# EAGLE design LDO (EAGLE 6.4)
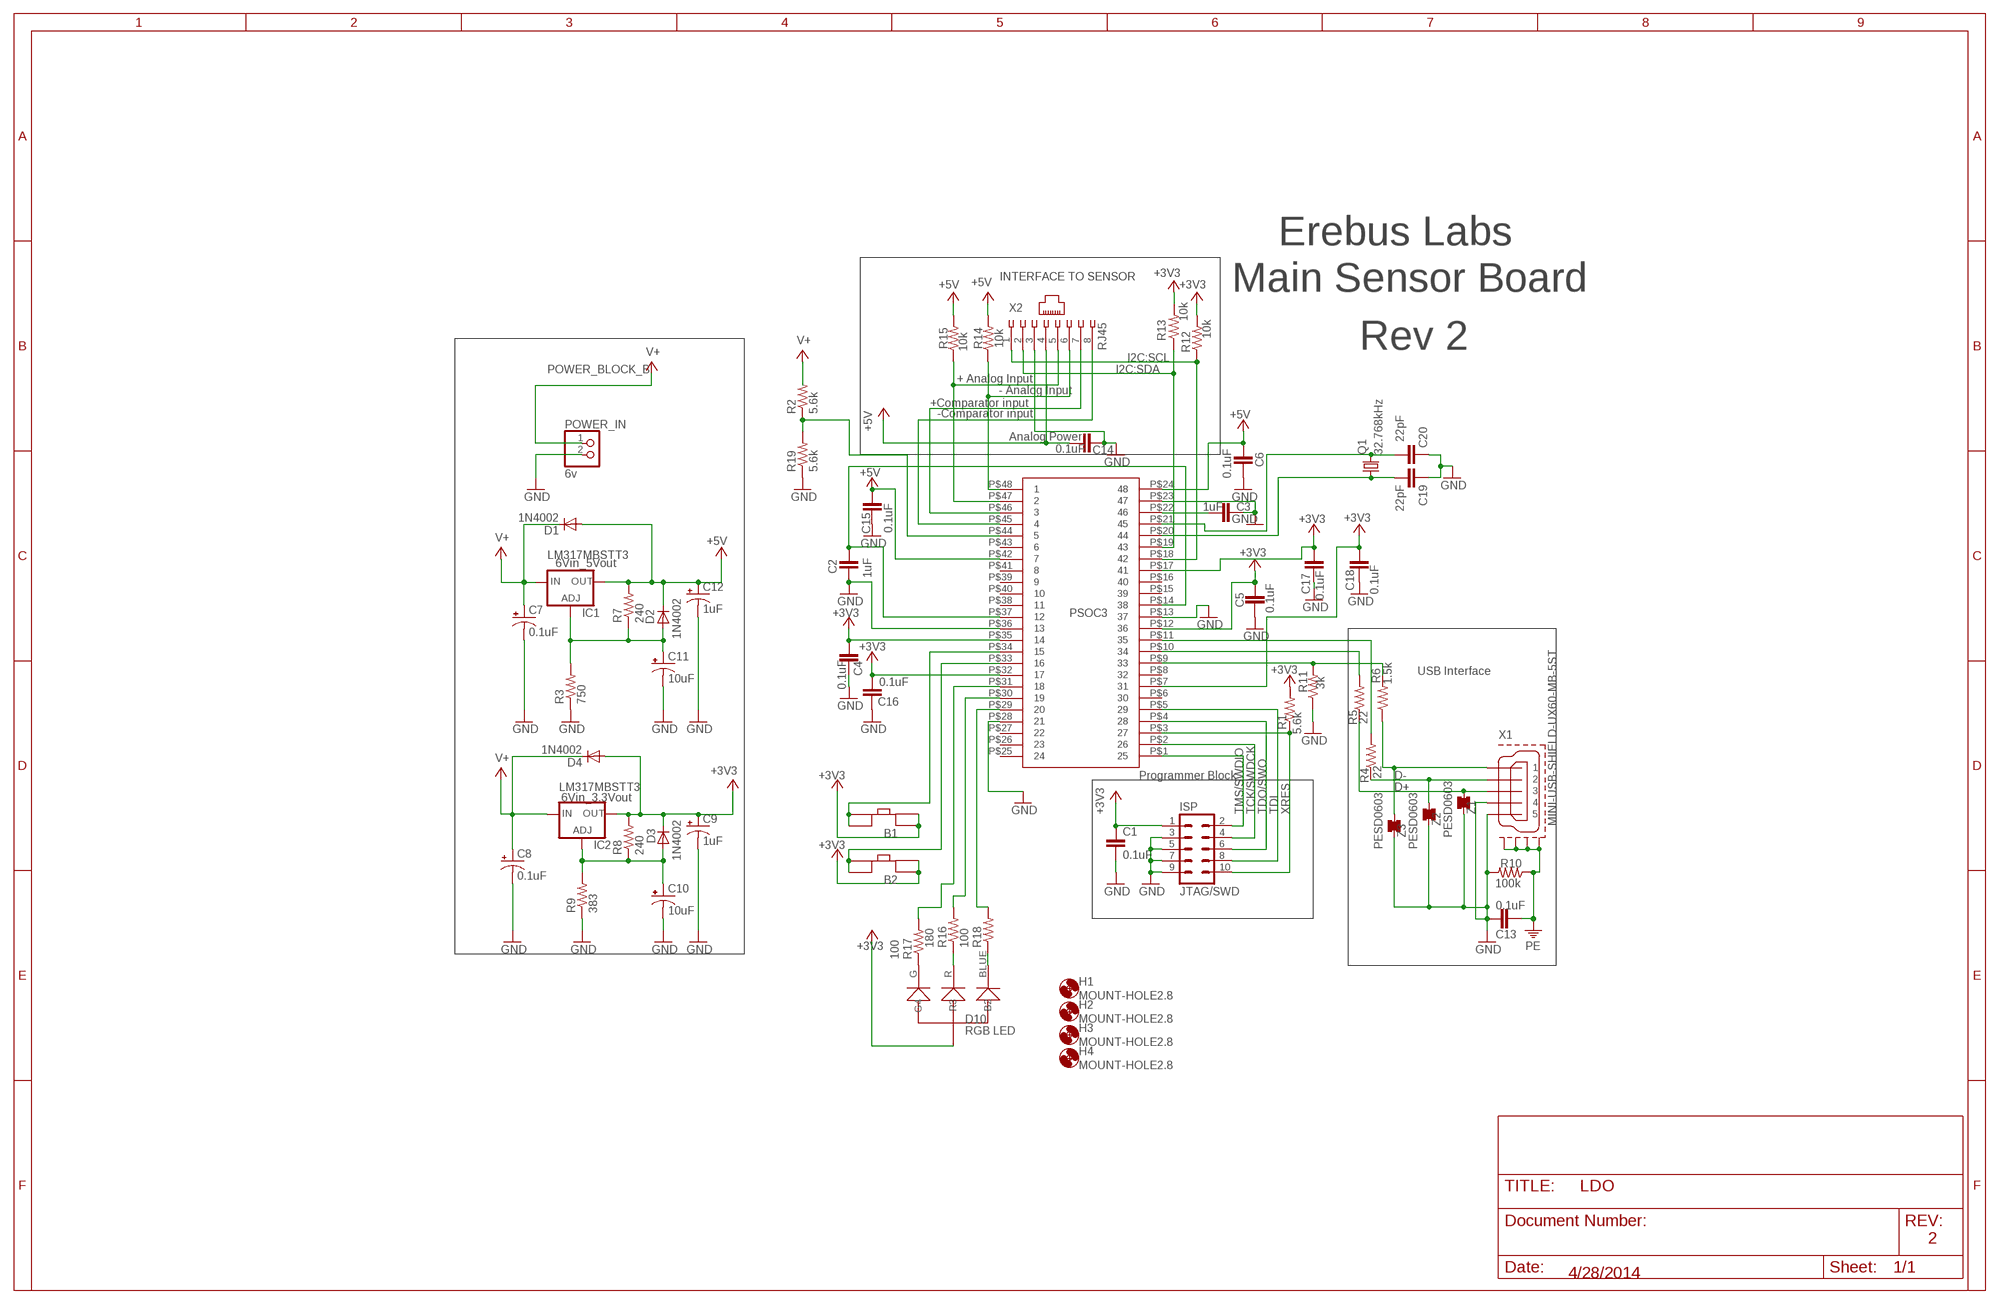
[diagram p0: schematic, sheet 1]

## Parts
C1  0.1uF  C-EUC0603K  [C0603K]
C2  1uF  C-EUC0603  [C0603]
C3  1uF  C-EUC0603  [C0603]
C4  0.1uF  C-EUC0603K  [C0603K]
C5  0.1uF  C-EUC0603K  [C0603K]
C6  0.1uF  C-EUC0603K  [C0603K]
C7  0.1uF  CPOL-USE2-5  [E2-5]
C8  0.1uF  CPOL-USE2-5  [E2-5]
C9  1uF  CPOL-USE2-5  [E2-5]
C10  10uF  CPOL-USE2-5  [E2-5]
C11  10uF  CPOL-USE2-5  [E2-5]
C12  1uF  CPOL-USE2-5  [E2-5]
C13  0.1uF  C-EUC0603K  [C0603K]
C14  0.1uF  C-EUC0603K  [C0603K]
C15  0.1uF  C-EUC0603K  [C0603K]
C16  0.1uF  C-EUC0603K  [C0603K]
C17  0.1uF  C-EUC0603K  [C0603K]
C18  0.1uF  C-EUC0603K  [C0603K]
C19  22pF  C-EUC0603  [C0603]
C20  22pF  C-EUC0603  [C0603]
D1  1N4002  DIODE-DO41-7.6  [DO41-7.6]
D2  1N4002  DIODE-DO41-7.6  [DO41-7.6]
D3  1N4002  DIODE-DO41-7.6  [DO41-7.6]
D4  1N4002  DIODE-DO41-7.6  [DO41-7.6]
D6  RGB_LED  [RGB_LED]
H1  MOUNT-HOLE2.8  [2,8]
H2  MOUNT-HOLE2.8  [2,8]
H3  MOUNT-HOLE2.8  [2,8]
H4  MOUNT-HOLE2.8  [2,8]
IC1  LM317MBSTT3  [SOT223]
IC2  LM317MBSTT3  [SOT223]
ISP  JTAG/SWD  FTSH-105-01-L-DV-K  [FTSH-105-01-L-DV-K]
POWER_IN  6v  PINHD-1X2  [1X02]
Q1  32.768kHz  CRYSTALTC38H  [TC38H]
R1  5.6k  R-US_R0805  [R0805]
R2  5.6k  R-US_R0805  [R0805]
R3  750  R-US_M1206  [M1206]
R4  22  R-US_R0603  [R0603]
R5  22  R-US_R0603  [R0603]
R6  1.5k  R-US_R0805  [R0805]
R7  240  R-US_M1206  [M1206]
R8  240  R-US_M1206  [M1206]
R9  383  R-US_M1206  [M1206]
R10  100k  R-US_R0805  [R0805]
R11  3k  R-US_R0805  [R0805]
R12  10k  R-US_R0805  [R0805]
R13  10k  R-US_R0805  [R0805]
R14  10k  R-US_R0805  [R0805]
R15  10k  R-US_R0805  [R0805]
R16  180  R-US_R0603  [R0603]
R17  100  R-US_R0603  [R0603]
R18  100  R-US_R0603  [R0603]
R19  5.6k  R-US_R0805  [R0805]
U$1  PSOC_3_48PIN_SSOP  [PSOC_3_48PIN_SSOP]
U$5  SPST  [SPST]
U$6  SPST  [SPST]
X1  MINI-USB-SHIELD-UX60-MB-5ST  [UX60-MB-5ST]
X2  RJ45  555167-1  [555167-1]
Z1  PESD0603  [SMD-0603]
Z2  PESD0603  [SMD-0603]
Z3  PESD0603  [SMD-0603]

## Nets
+3V3: C1.1 C4.2 C5.2 C9.+ C16.2 C17.2 C18.2 D3.C D4.A D6.VCC(VCC1) IC2.4(OUT) ISP.1 R1.2 R8.2 R12.2 R13.2 U$1.P$7 U$1.P$12 U$1.P$17 U$1.P$32 U$1.P$35 U$5.B1 U$5.B2 U$6.B1 U$6.B2
+5V: C6.2 C12.+ C14.2 C15.2 D1.A D2.C IC1.4(OUT) R7.2 R14.2 R15.2 U$1.P$24 U$1.P$42 X2.4
ANALOGINPUT: U$1.P$46 X2.7
GND: C1.2 C2.1 C3.1 C4.1 C5.1 C6.1 C7.- C8.- C9.- C10.- C11.- C12.- C13.2 C14.1 C15.1 C16.1 C17.1 C18.1 C19.1 C20.1 ISP.3 ISP.5 ISP.7 ISP.9 POWER_IN.2 R3.1 R9.1 R10.2 R11.1 R19.1 U$1.P$13 U$1.P$23 U$1.P$28 U$1.P$36 X1.4 X1.5 X2.3 Z1.1 Z2.1 Z3.1
N$1: R4.2 U$1.P$11
N$2: R5.2 U$1.P$10
N$3: R6.2 R11.2 U$1.P$9
N$4: ISP.2 U$1.P$1
N$5: ISP.4 U$1.P$2
N$6: ISP.6 U$1.P$4
N$7: ISP.8 U$1.P$5
N$8: ISP.10 R1.1 U$1.P$3
N$9: C2.2 U$1.P$14 U$1.P$37
N$10: C11.+ D2.A IC1.1(ADJ) R3.2 R7.1
N$11: C3.2 U$1.P$22
N$12: R2.1 R19.2 U$1.P$44
N$13: R5.1 X1.3 Z1.2
N$14: R4.1 X1.2 Z2.2
N$15: C10.+ D3.A IC2.1(ADJ) R8.1 R9.2
N$16: C20.2 Q1.2 U$1.P$21
N$17: R6.1 X1.1 Z3.2
N$18: R15.1 U$1.P$47 X2.5
N$19: R14.1 U$1.P$48 X2.6
N$20: R13.1 U$1.P$19 X2.2
N$21: R12.1 U$1.P$18 X2.1
N$23: C19.2 Q1.1 U$1.P$20
N$24: D6.G(G4) R17.1
N$25: D6.R(R3) R16.1
N$26: D6.BLUE(B2) R18.1
N$41: U$1.P$34 U$5.A1 U$5.A2
N$42: U$1.P$45 X2.8
N$43: R17.2 U$1.P$31
N$44: U$1.P$33 U$6.A1 U$6.A2
N$46: R16.2 U$1.P$30
N$47: R18.2 U$1.P$29
PE: C13.1 R10.1 X1.M1(GND1) X1.M2(GND2) X1.M3(GND3) X1.M4(GND4)
V+: C7.+ C8.+ D1.C D4.C IC1.3(IN) IC2.3(IN) POWER_IN.1 R2.2
Unconnected: U$1.P$6 U$1.P$8 U$1.P$15 U$1.P$16 U$1.P$25 U$1.P$26 U$1.P$27 U$1.P$38 U$1.P$39 U$1.P$40 U$1.P$41 U$1.P$43

## Notes on the sheet
- Erebus Labs
- INTERFACE TO SENSOR
- Main Sensor Board
- Rev 2
- I2C:SCL
- POWER_BLOCK_B | I2C:SDA
- + Analog Input
- - Analog Input
- +Comparator input
- -Comparator input
- Analog Power
- 6Vin_5Vout
- PSOC3
- USB Interface
- Programmer Block | D-
- D+
- 6Vin_3.3Vout
- TMS/SWDIO | TCK/SWDCK | TDO/SWO | TDI | XRES
- B1
- B2
- D10
- RGB LED
- 2
- 4/28/2014

## Library data of the parts
C1-C6 C13-C20 = rcl:C-EU: CAPACITOR, European symbol
C7-C12 = rcl:CPOL-US: POLARIZED CAPACITOR, American symbol
D1-D4 = diode:DIODE-: DIODE
D6 = RGB_LED:RGB_LED
H1-H4 = holes:MOUNT-HOLE: MOUNTING HOLE with drill center marker
IC1 IC2 = v-reg:LM317?*: 500 mA Adjustable Output Positive Voltage Regulator Source: http://www.onsemi.co.jp .. LM317M-D.PDF
ISP = con-samtec:FTSH-105-01-L-DV-K: FTSH Pin Header
POWER_IN = pinhead:PINHD-1X2: PIN HEADER
Q1 = crystal:CRYSTAL: CRYSTAL; OC_FARNELL: unknown; OC_NEWARK: unknown
R1-R19 = rcl:R-US_: RESISTOR, American symbol
U$1 = PSOC_48SSOP:PSOC_3_48PIN_SSOP
U$5 U$6 = Switches_SPST:SPST
X1 = usb_con-update:MINI-USB-SHIELD-: MINI USB Connector Source: http://www.hirose.co.jp/cataloge_hp/e24000019.pdf
X2 = con-amp:555167-1: AMP connector
Z1-Z3 = supressor:PESD: ESD SUPPRESSOR Polymeric ESD Suppressor, Raychem PESD Series

## Board
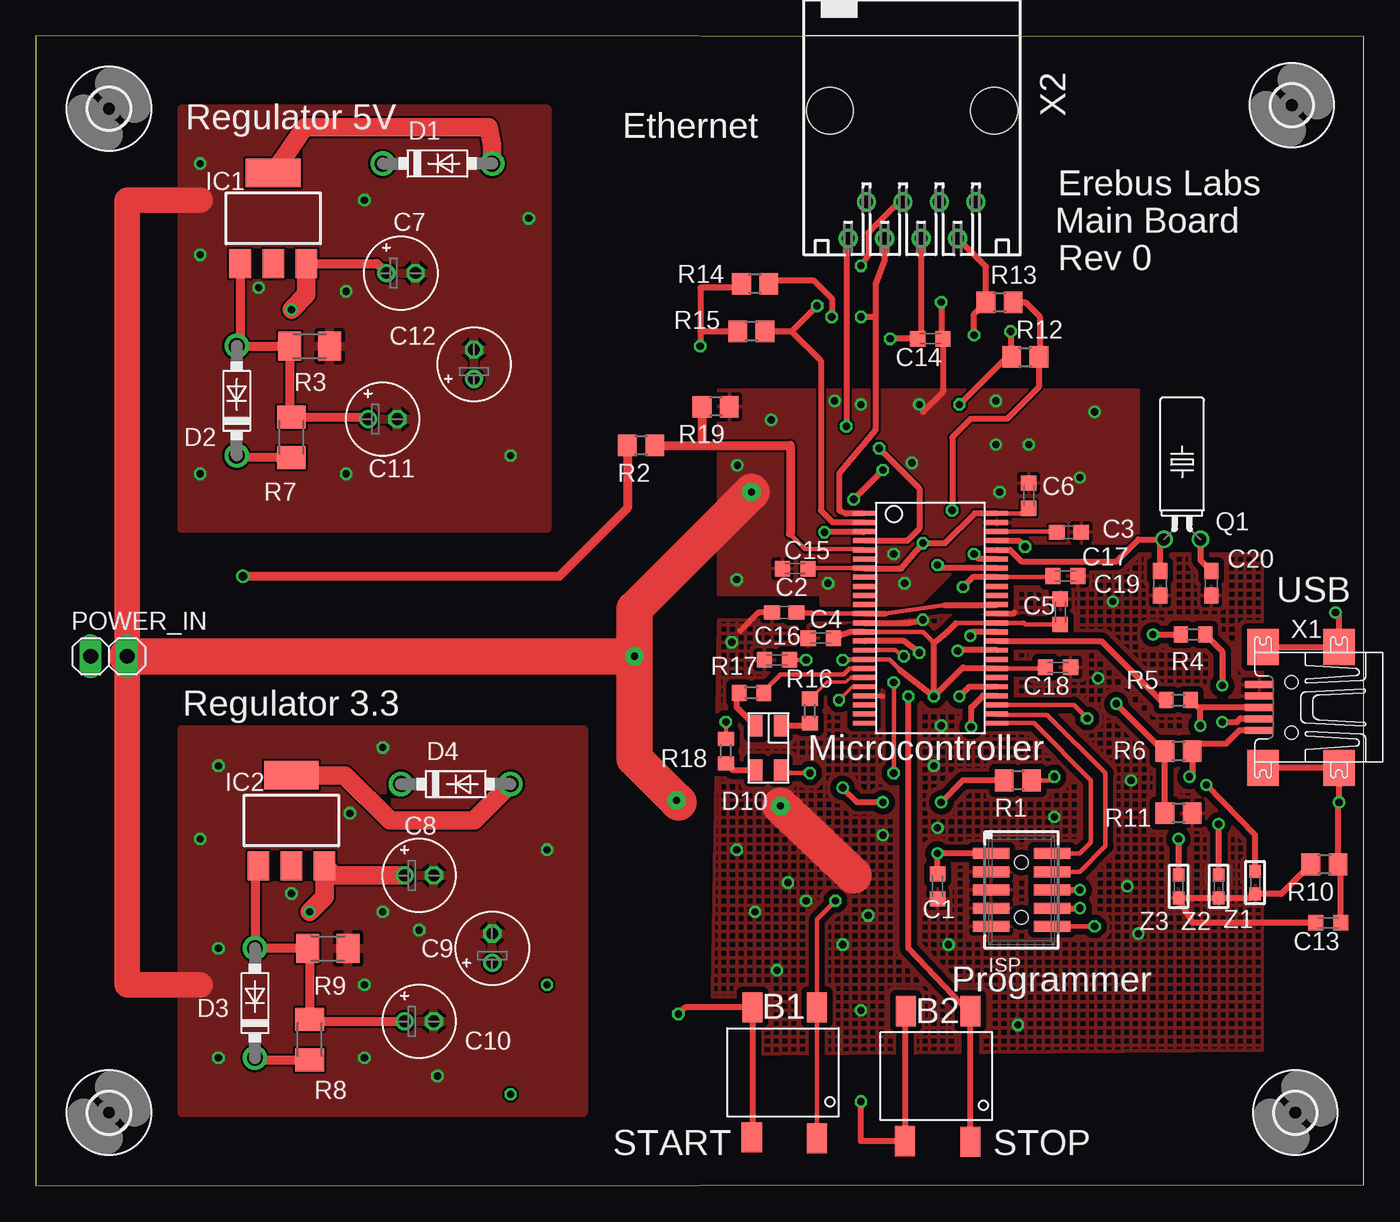
[diagram p1: board, top side]
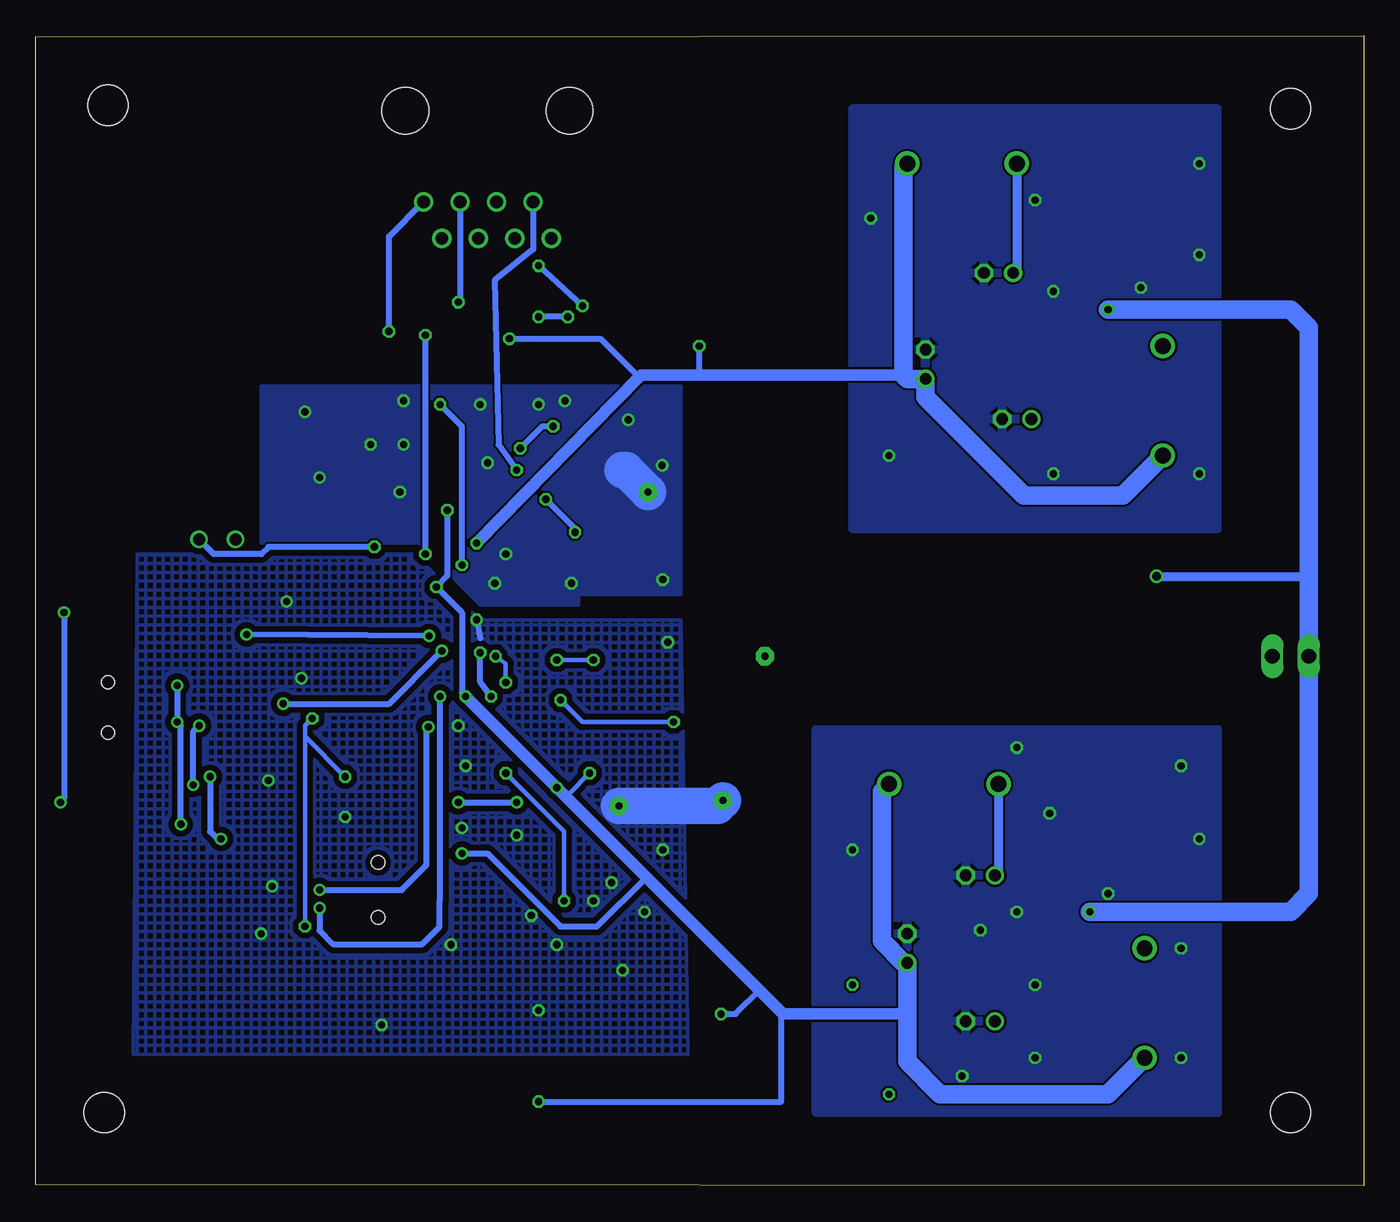
[diagram p2: board, bottom side, seen from below]

Size 92.38 x 80 mm. Coordinates in mm from the lower left corner, seen from the top.
Outline: 0,0 92.38,0.05 92.38,79.95 0,80 0,0
Copper layers (1*16): Top 0.0356mm / dielectric 1.5011mm / Bottom 0.0356mm
Design rules "LaenPCBOrder": minimum track width 6mil, minimum drill 13mil, track to track 6mil, track to pad 6mil, pad to pad 6mil, via to via 6mil, smd to smd 6mil, copper to edge 15mil, drill to drill 6mil, minimum pad ring 7mil, minimum via ring 7mil, stop-mask expansion 3mil, vias tented up to drill 0mil, thermal gap 10mil

### Footprints (pad centres in the part's own frame; a part is rotated, then mirrored left to right if it is on the bottom)
C0603K = smd 1.05 x 1.08: 1 -0.875,0; 2 0.875,0
C0603 = smd 1.1 x 1: 1 -0.85,0; 2 0.85,0
E2-5 = drill 0.813 pad 1.27: + -1.016,0 | drill 0.813 pad 1.27 octagon: - 1.016,0
DO41-7.6 = drill 1.1 pad 1.7: A 3.81,0; C -3.81,0
RGB_LED = smd 1.5 x 0.9: BLUE 3.1,-1.7; G 0,-1.7; R 0,0; VCC 3.1,0
2,8 = hole 2.8: 0,0
SOT223 = smd 1.5 x 2: 1 -2.3,-3.15; 2 0,-3.15; 3 2.3,-3.15 | smd 3.8 x 2: 4 0,3.15
FTSH-105-01-L-DV-K = smd 0.762 x 2.54: 1 -2.54,-2.121; 2 -2.54,2.121; 3 -1.27,-2.121; 4 -1.27,2.121; 5 0,-2.121; 6 0,2.121; 7 1.27,-2.121; 8 1.27,2.121; 9 2.54,-2.121; 10 2.54,2.121 | hole 0.94: -1.905,0; 1.905,0
1X02 = drill 1.016 long: 1 -1.27,0; 2 1.27,0
TC38H = drill 0.813: 1 -1.27,0; 2 1.27,0
R0805 = smd 1.3 x 1.5: 1 -0.95,0; 2 0.95,0
M1206 = smd 1.6 x 2: 1 -1.4,0; 2 1.4,0
R0603 = smd 1 x 1.1: 1 -0.85,0; 2 0.85,0
PSOC_3_48PIN_SSOP = smd 0.343 x 1.524: P$1 0.679,-0.827; P$2 1.314,-0.827; P$3 1.949,-0.827; P$4 2.584,-0.827; P$5 3.219,-0.827; P$6 3.854,-0.827; P$7 4.489,-0.827; P$8 5.124,-0.827; P$9 5.759,-0.827; P$10 6.394,-0.827; P$11 7.029,-0.827; P$12 7.664,-0.827; P$13 8.299,-0.827; P$14 8.934,-0.827; P$15 9.569,-0.827; P$16 10.204,-0.827; P$17 10.839,-0.827; P$18 11.474,-0.827; P$19 12.109,-0.827; P$20 12.744,-0.827; P$21 13.379,-0.827; P$22 14.014,-0.827; P$23 14.649,-0.827; P$24 15.284,-0.827; P$25 0.679,8.421; P$26 1.314,8.421; P$27 1.949,8.421; P$28 2.584,8.421; P$29 3.219,8.421; P$30 3.854,8.421; P$31 4.489,8.421; P$32 5.124,8.421; P$33 5.759,8.421; P$34 6.394,8.421; P$35 7.029,8.421; P$36 7.664,8.421; P$37 8.299,8.421; P$38 8.934,8.421; P$39 10.204,8.421; P$40 9.569,8.421; P$41 10.839,8.421; P$42 11.474,8.421; P$43 12.109,8.421; P$44 12.744,8.421; P$45 13.379,8.421; P$46 14.014,8.421; P$47 14.649,8.421; P$48 15.284,8.421
SPST = smd 1.4 x 2.1: A1 0,0; A2 0,-9.1; B1 4.55,-0.05; B2 4.5,-9.1
UX60-MB-5ST = smd 2 x 0.5: 1 2.25,1.6; 2 2.25,0.8; 3 2.25,0; 4 2.25,-0.8; 5 2.25,-1.6 | smd 2.2 x 2.5: M1 -3.3,-4.2; M2 -3.3,4.2; M3 2,4.2; M4 2,-4.2 | hole 0.9: 0,-1.75; 0,1.75
555167-1 = drill 0.889: 1 -4.445,5.207; 2 -3.175,7.747; 3 -1.905,5.207; 4 -0.635,7.747; 5 0.635,5.207; 6 1.905,7.747; 7 3.175,5.207; 8 4.445,7.747 | hole 3.251: -5.715,-1.143; 5.715,-1.143
SMD-0603 = smd 0.9 x 0.8: 1 -0.794,0; 2 0.794,0

### Placement (x,y rotation side)
C1  62.74,20.83 270 top
C2  52.07,39.88 0 top
C3  71.88,45.47 180 top
C4  54.61,38.1 0 top
C5  71.27,39.93 270 top
C6  69.09,48.01 270 top
C7  25.4,63.5 0 top
C8  26.67,21.59 0 top
C9  31.75,16.51 90 top
C10  26.67,11.43 0 top
C11  24.13,53.34 0 top
C12  30.48,57.15 90 top
C13  89.92,18.29 180 top
C14  62.23,58.93 180 top
C15  52.83,42.93 0 top
C16  51.56,36.58 0 top
C17  71.63,42.42 180 top
C18  71.12,36.07 180 top
C19  78.23,41.91 90 top
C20  81.79,41.91 90 top
D1  27.94,71.12 0 top
D2  13.97,54.61 90 top
D3  15.24,12.7 90 top
D4  29.21,27.94 0 top
D6  51.82,32 270 top
H1  5.08,74.93 0 top
H2  5.08,5.08 0 top
H3  87.38,75.18 0 top
H4  87.63,5.08 0 top
IC1  16.51,67.31 0 top
IC2  17.78,25.4 0 top
ISP  68.58,20.57 270 top
POWER_IN  5.08,36.83 0 top
Q1  79.76,44.96 0 top
R1  68.33,28.19 180 top
R2  42.1,51.5 180 top
R3  19.05,58.42 180 top
R4  80.52,38.35 180 top
R5  79.5,33.78 180 top
R6  79.5,30.23 180 top
R7  17.78,52.07 270 top
R8  19.05,10.16 270 top
R9  20.32,16.51 180 top
R10  89.66,22.35 180 top
R11  79.5,25.91 180 top
R12  68.83,57.66 0 top
R13  67.06,61.47 0 top
R14  50.04,62.74 180 top
R15  49.78,59.44 180 top
R16  53.85,33.02 90 top
R17  49.78,34.29 0 top
R18  48.01,30.23 90 top
R19  47.3,54.2 180 top
U$1  66.04,31.5 90 top
U$5  65.02,3.05 180 top
U$6  54.36,3.3 180 top
X1  87.38,33.27 180 top
X2  60.96,73.66 180 top
Z1  84.84,21.08 90 top
Z2  82.3,20.83 90 top
Z3  79.5,20.83 90 top

### Tracks (layer width: path | path; a pad name or v marks a point on that pad's centre or on a via)
+3V3  (via drill 0.5 pad 0.25)
  Top 0.305: U$1.P$17 70.67,42.34 | U$1.P$7 70.16,35.98 | 56.13,36.62 U$1.P$32 59.39,36.62 60.15,35.86 | v53.59,36.58 C16.2 | U$1.P$35 61.72,38.52 62.48,37.76 | D6.VCC 52.02,28.7 v53.85,28.7 | 64.01,39.12 64.05,39.16 U$1.P$12 68.66,39.16 68.7,39.2 68.84,39.06 C5.2
  Top 0.406: 64.01,39.12 63.42,38.52 62.48,37.76 v62.48,34.04 | 70.67,42.34 C17.2 | 70.16,35.98 C18.2 | U$1.P$35 56.7,38.52 C4.2 | 56.13,36.62 v56.13,36.58 | 60.15,35.86 v62.48,34.04 | v62.48,34.04 64.52,36.07 64.6,35.98 U$1.P$7 | U$1.P$17 65.19,42.34 v64.52,41.66 | R13.2 68.83,61.47 69.85,60.45 69.85,57.72 R12.2 69.78,55.56 67.56,53.34 65.02,53.34 63.75,52.07 v63.75,46.99 | U$6.B1 49.86,3.4 U$6.B2 45.17,12.4 v44.7,11.94 | U$5.B2 60.47,12.15 U$5.B1 57.4,3.1 v57.4,5.84 | R1.2 64.52,28.19 v62.99,26.67 | v58.93,26.67 57.15,26.67 v56.13,27.69 | ISP.1 v62.74,23.11 C1.1
  Top 0.61: D3.C 15.37,8.76 R8.2
  Top 1.27: IC2.4 21.49,28.55 24.64,25.4 30.48,25.4 D4.A
  Bottom 0.305: v56.13,36.58 v53.59,36.58 | v53.85,28.7 55.24,27.3 55.24,26.8
  Bottom 0.406: v62.48,34.04 62.74,34.29 62.74,39.88 v64.52,41.66 63.75,42.42 v63.75,46.99 | v44.7,11.94 43.69,11.94 42.04,13.59 | v57.4,5.84 40.51,5.84 40.51,12.06 | v62.99,26.67 v58.93,26.67 | v62.74,23.11 60.96,23.11 55.88,18.03 53.34,18.03 49.91,21.46
  Bottom 0.813: v62.48,34.04 v56.13,27.69 55.24,26.8 49.91,21.46 42.04,13.59 40.51,12.06 40.39,11.94 31.75,11.94
  Bottom 1.27: D4.A 33.53,27.43 33.53,17.02 32,15.49 C9.+ 31.75,11.94 31.75,8.64 29.46,6.35 17.78,6.35 D3.C
+5V  (via drill 0.5 pad 0.25)
  Top 0.305: U$1.P$42 53.75,42.97 | U$1.P$24 69.09,46.78 C6.2
  Top 0.406: 53.75,42.97 C15.2 | U$1.P$24 65.32,46.78 63.25,44.7 v61.72,44.7 60.2,42.93 57.66,42.93 U$1.P$42 | R14.2 48.83,62.48 46.23,62.48 46.23,59.44 | R15.2 46.23,59.44 | 46.23,59.44 v46.23,58.42 | C14.2 61.59,59.17 X2.4 61.59,59.05 61.47,58.93 v59.44,58.93
  Top 0.61: R7.2 14.1,50.67 D2.C
  Top 1.27: D1.A 31.75,72.39 31.5,73.66 18.69,73.66 IC1.4
  Bottom 0.406: v46.23,58.42 46.23,56.39 | v59.44,58.93 53.09,58.93 50.42,56.26
  Bottom 0.61: 30.73,55.88 C12.+
  Bottom 0.813: 32,56.39 46.23,56.39 50.29,56.39 50.42,56.26 v61.72,44.7
  Bottom 1.27: D1.A 32,70.87 32,56.39 31.75,56.13 C12.+ 30.48,54.86 23.62,48.01 16.76,48.01 D2.C
ANALOGINPUT  (via drill 0.5 pad 0.25)
  Top 0.406: v58.93,49.78 v56.9,47.75 | 55.12,45.47 v54.86,45.47 57.57,45.47 U$1.P$46
  Bottom 0.406: X2.7 57.78,65.15 60.45,62.99 60.2,51.56 v58.93,49.78 | v56.9,47.75 54.86,45.72 v54.86,45.47
GND  (via drill 0.5 pad 0.25, 0.5 pad 1.27)
  Top 0.305: U$1.P$28 58.88,34.08 58.93,34.04
  Top 0.406: U$1.P$13 67.99,39.8 68.07,39.88 | v62.99,61.47 62.99,59.04 C14.1 63.1,55.23 61.72,53.85 | U$1.P$36 60.75,39.16 v61.72,39.37 | C2.1 50.29,39.88 49.02,38.61 | C13.2 80.49,18.29 Z3.1 Z2.1 84.58,20.03 Z1.1 86.65,20.29 R10.2
  Top 1.778: 11.43,68.58 6.35,68.58 POWER_IN.2 6.35,13.97 11.43,13.97
  Top 2.54: v41.66,36.83 POWER_IN.2 | v51.82,26.42 56.9,21.59 | v49.78,48.26 41.66,40.13 v41.66,36.83 | v41.66,36.83 41.66,29.72 v44.58,26.8 44.7,26.67
  Bottom 0.406: X2.3 62.87,61.59 v62.99,61.47 | v61.72,39.37 61.47,38.1
  Bottom 2.54: v49.78,48.26 51.31,49.78 51.56,49.78 | v51.82,26.42 44.96,26.42 v44.58,26.8
  other vias: 11.43,49.53 21.59,49.53 33.02,50.8 21.59,62.23 11.43,64.77 11.43,71.12 22.86,68.58 34.29,67.31 15.49,62.48 12.7,29.21 24.13,30.48 21.84,25.91 11.43,24.13 17.78,20.32 12.7,16.51 12.7,8.89 22.86,8.89 27.94,7.62 22.86,13.97 26.67,17.78 24.13,19.05 35.56,23.37 60.96,50.29 69.09,51.56 48.41,37.81 56.13,16.76 55.12,41.91 60.45,41.91 59.69,43.94 67.06,48.26 66.8,54.61 48.77,42.16 53.59,19.81 70.87,25.65 62.48,29.21 62.99,32 48.77,23.37 50.04,19.05 52.32,21.08 51.56,14.99 57.91,18.8 57.4,12.19 63.5,16.76 68.33,11.18 58.93,24.38 62.74,24.89 76.71,17.53 75.95,20.83 76.2,28.19 73.91,35.31 74.93,40.64 51.17,53.29 48.81,50.12 55.57,54.61 57.4,54.36 61.47,54.36 66.8,51.56 72.64,49.28 73.66,53.85
  pour Top: 10.16,74.93 35.56,74.93 35.56,45.72 10.16,45.72
  pour Bottom: 10.16,74.93 35.56,74.93 35.56,45.72 10.16,45.72
  pour Bottom: 10.16,31.75 10.16,5.08 38.1,5.08 38.1,31.75
  pour Top: 10.16,31.75 38.1,31.75 38.1,5.08 10.16,5.08
  pour Top: 47.5,41.15 54.61,41.15 54.61,40.39 61.47,40.39 65.79,44.7 76.71,44.7 76.71,55.37 47.5,55.37
  pour Bottom: 47.5,41.15 54.61,41.15 54.61,40.39 61.47,40.39 65.79,44.7 76.71,44.7 76.71,55.63 47.5,55.63
  pour Bottom (isolate 0.406, hatched): 47.5,39.37 61.47,39.37 66.04,43.94 85.34,43.94 85.6,9.14 46.99,9.14
  pour Top (isolate 0.406, rank 4, hatched): 47.5,39.37 61.47,39.37 66.04,43.94 85.34,43.94 85.34,9.4 46.99,9.14
N$1  (via drill 0.5 pad 0.25)
  Top 0.406: U$1.P$11 65.19,38.52 v65.02,38.25 | v77.72,38.35 R4.2
  Bottom 0.406: v65.02,38.25 v77.72,38.35
N$2
  Top 0.406: R5.2 78.23,33.78 74.12,37.89 U$1.P$10
N$3  (via drill 0.5 pad 0.25)
  Top 0.406: R11.2 R6.2 78.49,30.23 v75.18,33.53 | U$1.P$9 64.18,37.26 v64.14,37.21
  Bottom 0.406: v75.18,33.53 67.82,33.53 64.39,36.96 v64.14,37.21 64.01,37.34
N$4
  Top 0.305: U$1.P$1 69.42,32.17 73.41,28.19 73.41,23.88 72.64,23.11 ISP.2
N$5
  Top 0.305: ISP.4 72.64,21.84 74.42,23.62 74.42,28.7 70.36,32.77 66.91,32.77 U$1.P$2
N$6  (via drill 0.5 pad 0.25)
  Top 0.406: ISP.6 v72.64,20.57 | v65.08,31.92 65.08,33.27 65.88,34.08 U$1.P$4
  Bottom 0.406: v72.64,20.57 66.93,20.57 65.2,22.3 65.2,31.8 v65.08,31.92
N$7  (via drill 0.5 pad 0.25)
  Top 0.406: ISP.8 v72.64,19.3 | v64.26,34.04 64.94,34.72 U$1.P$5
  Bottom 0.406: v64.26,34.04 64.26,19.81 64.3,19.77 64.3,18 65.5,16.8 71.7,16.8 72.64,17.74 v72.64,19.3
N$8  (via drill 0.5 pad 0.25)
  Top 0.305: ISP.10 v73.66,18.03 | U$1.P$3 72.22,33.45 v73.15,32.51 | R1.1 70.61,28.19 v70.87,28.45
  Bottom 0.305: v73.66,18.03 73.66,31.24 | v73.15,32.51 73.66,32 73.66,31.5 73.66,31.24 | v70.87,28.45 73.66,31.24
N$9
  Top 0.305: 59.1,39.8 63.25,40.39 | U$1.P$37 54.02,39.8
  Top 0.406: U$1.P$37 59.1,39.8 | 63.25,40.39 66.82,40.39 U$1.P$14 | 54.02,39.8 C2.2
N$10
  Top 0.61: IC1.1 14.21,58.66 D2.A R3.2 17.65,53.6 R7.1 22.98,53.47 C11.+
N$11
  Top 0.305: U$1.P$22 70.99,45.51
  Top 0.406: 70.99,45.51 C3.2
N$12
  Top 0.305: 52.5,45.4 52.5,45.3 53.5,44.3 57.56,44.3 U$1.P$44
  Top 0.61: R2.1 46.4,51.5 | 46.4,51.5 52.5,51.5 52.5,45.4 | R19.2 46.35,51.55 46.4,51.5
N$13  (via drill 0.5 pad 0.25)
  Top 0.406: X1.3 80.86,33.27 R5.1 81.03,33.11 v81.03,32 | Z1.2 84.84,24.38 v81.43,27.89
  Bottom 0.406: v81.43,27.89 81.43,31.6 v81.03,32
N$14  (via drill 0.5 pad 0.25)
  Top 0.406: R4.1 82.55,37.17 v82.55,34.8 | v82.55,32.26 83.57,32.26 83.82,32.51 85.09,32.51 X1.2 | Z2.2 v82.3,25.15
  Bottom 0.406: v82.55,34.8 v82.55,32.26 82.3,32 v82.3,25.15
N$15
  Top 0.61: IC2.1 15.24,22.01 D3.A R9.2 19.05,16.38 R8.1 19.18,11.43 C10.+
N$16  (via drill 0.5 pad 0.25)
  Top 0.406: U$1.P$21 68.41,44.88 v68.83,44.45 | Q1.2 81.03,43.52 C20.2
  Bottom 0.406: v68.83,44.45 76.2,44.45 76.71,43.94 80.01,43.94 Q1.2
N$17  (via drill 0.5 pad 0.25)
  Top 0.406: X1.1 83.74,31.67 82.8,30.73 80.96,30.73 R6.1 80.45,28.64 v80.26,28.45 | v79.5,24.13 Z3.2
  Bottom 0.406: v80.26,28.45 80.26,24.64 79.5,23.88 v79.5,24.13
N$18  (via drill 0.5 pad 0.25)
  Top 0.406: X2.5 60.07,68.45 57.91,66.29 57.91,64.77 v57.4,64.01 | v54.36,61.21 52.58,59.44 | 52.58,59.44 R15.1 | 52.58,59.44 54.61,57.4 54.61,46.99 55.45,46.15 U$1.P$47
  Bottom 0.406: v57.4,64.01 v54.36,61.21
N$19  (via drill 0.5 pad 0.25)
  Top 0.406: X2.6 59.05,64.39 58.42,62.74 58.42,60.45 | R14.1 51.24,62.99 54.1,62.99 55.37,61.72 v55.37,60.45 | 58.42,60.45 58.42,52.58 55.88,49.53 55.88,46.99 56.39,46.74 56.43,46.78 U$1.P$48 | v57.4,60.45 58.42,60.45
  Bottom 0.406: v55.37,60.45 v57.4,60.45
N$20  (via drill 0.5 pad 0.25)
  Top 0.406: U$1.P$19 65.61,43.6 v65.28,43.94 | v65.28,59.18 65.28,60.64 R13.1 66.11,63.94 X2.2
  Bottom 0.406: v65.28,43.94 v65.28,59.18
N$21  (via drill 0.5 pad 0.25)
  Top 0.406: v67.82,59.44 67.88,59.37 R12.1 67.56,57.66 v64.26,54.36 | U$1.P$18 62.95,42.97 v62.74,43.18
  Bottom 0.406: v67.82,59.44 67.82,66.04 X2.1 | v62.74,43.18 62.74,52.83 v64.26,54.36
N$23
  Top 0.406: U$1.P$20 67.77,44.24 68.58,43.43 75.18,43.43 76.71,44.96 Q1.1 78.23,44.7 C19.2
N$24
  Top 0.406: D6.G 50.04,32 48.77,33.27 48.77,34.12 R17.1
N$25
  Top 0.406: D6.R 53.68,32 R16.1
N$26
  Top 0.406: D6.BLUE 48.48,28.9 R18.1
N$37  (via drill 0.5 pad 0.25)
  other vias: 33.02,6.35
N$38  (via drill 0.5 pad 0.25)
  other vias: 35.56,13.97
N$41  (via drill 0.5 pad 0.25)
  Top 0.406: 65.02,11.94 U$5.A2 | U$5.A1 65.02,11.94 | 65.02,11.94 60.71,16.51 v60.71,34.04 | v61.47,37.08 60.41,37.89 U$1.P$34
  Bottom 0.406: v60.71,34.04 61.47,35.05 v61.47,37.08
N$42  (via drill 0.5 pad 0.25)
  Top 0.406: X2.8 56.39,65.79 v56.39,52.83 | v58.67,51.31 61.47,48.51 61.47,45.72 60.62,44.88 U$1.P$45
  Bottom 0.406: v56.39,52.83 57.15,52.83 v58.67,51.31
N$43
  Top 0.305: U$1.P$31 56.61,35.98 56.19,35.56 51.82,35.56 50.63,34.38
  Top 0.406: 50.63,34.38 R17.2
N$44  (via drill 0.5 pad 0.25)
  Top 0.305: U$6.A1 U$6.A2 54.36,18.54 v55.63,19.81 | v59.69,28.7 v59.69,35.01 | v60.4,36.83 59.77,37.26 U$1.P$33
  Bottom 0.305: v55.63,19.81 55.63,24.64 v59.69,28.7 | v59.69,35.01 59.69,36.32 v60.4,36.83
N$46
  Top 0.254: 56.74,35.35 56.34,35.05 55.03,35.05 R16.2
  Top 0.305: U$1.P$30 56.74,35.35
N$47  (via drill 0.5 pad 0.25)
  Top 0.254: v55.88,33.78 56.81,34.72 U$1.P$29
  Top 0.305: R18.2 v48.01,32.26
  Bottom 0.305: v48.01,32.26 54.36,32.26 v55.88,33.78
PE  (via drill 0.5 pad 0.25)
  Top 0.406: X1.M4 X1.M1 90.68,39.63 v90.42,39.88 | X1.M3 X1.M2 v90.68,26.67 90.61,26.6 R10.1 90.79,22.17 C13.1
  Bottom 0.406: v90.42,39.88 90.42,26.92 v90.68,26.67
V+  (via drill 0.5 pad 0.61, 0.6)
  Top 0.61: IC1.3 23.72,64.16 C7.+ | R2.2 41.15,47.15 36.4,42.4 v14.4,42.4
  Top 1.27: IC1.3 18.81,61.99 v17.78,60.96 | v19.05,19.05 20.08,20.08 IC2.3 20.74,21.59 C8.+
  Bottom 0.61: D1.C 24.13,63.75 C7.+ | D4.C 25.4,21.84 C8.+ | v14.4,42.4 3.91,42.4 3.81,42.3
  Bottom 1.27: v17.78,60.96 5.08,60.96 3.81,59.69 3.81,42.3 POWER_IN.1 3.81,20.32 5.08,19.05 v19.05,19.05

### Text on the board
tNames: Regulator 5V | Ethernet | Erebus Labs | Main Board | Rev 0 | USB | Regulator 3.3 | Microcontroller | D10 | Programmer | B1 | B2 | START | STOP